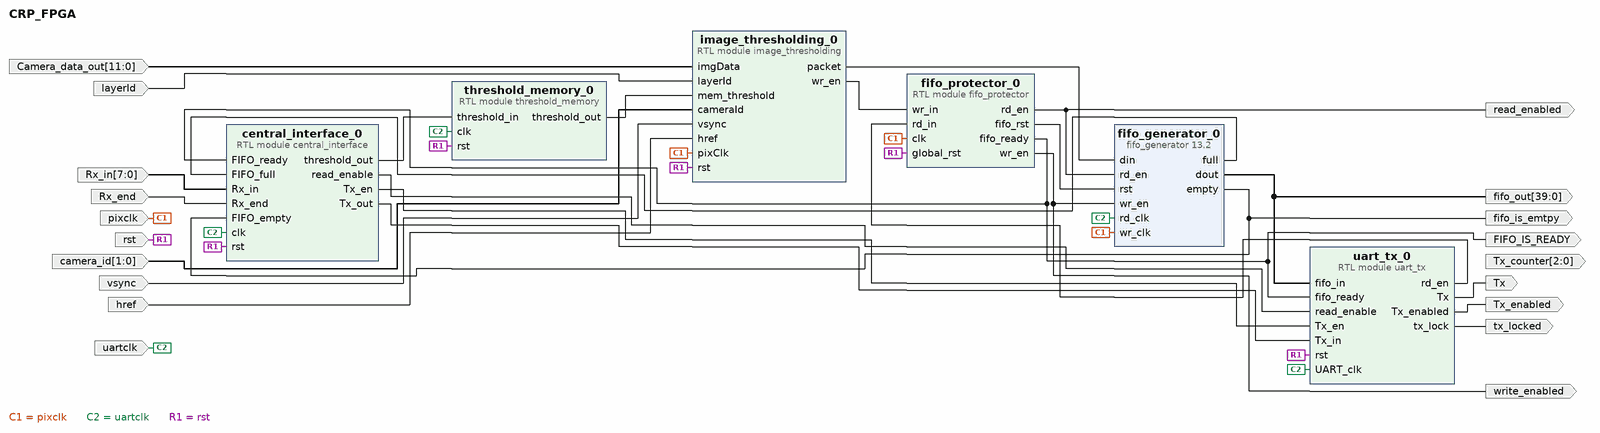
[diagram p0: block diagram of the top level]
# Vivado block design CRP_FPGA, xc7a15tcpg236-1, Vivado 2018.2
create_bd_design CRP_FPGA

create_bd_port -dir I -from 11 -to 0 Camera_data_out
create_bd_port -dir I pixclk
create_bd_port -dir I -from 7 -to 0 Rx_in
create_bd_port -dir I Rx_end
create_bd_port -dir I layerId
create_bd_port -dir I -from 1 -to 0 camera_id
create_bd_port -dir I vsync
create_bd_port -dir I href
create_bd_port -dir I rst
create_bd_port -dir I uartclk
create_bd_port -dir O -from 39 -to 0 fifo_out
create_bd_port -dir O write_enabled
create_bd_port -dir O read_enabled
create_bd_port -dir O Tx
create_bd_port -dir O Tx_enabled
create_bd_port -dir O -from 2 -to 0 Tx_counter
create_bd_port -dir O tx_locked
create_bd_port -dir O FIFO_IS_READY
create_bd_port -dir O -type data fifo_is_emtpy

create_bd_cell -type module -reference central_interface central_interface_0
create_bd_cell -type ip -vlnv xilinx.com:ip:fifo_generator:13.2 fifo_generator_0
set_property -dict [list \
  CONFIG.Fifo_Implementation Independent_Clocks_Builtin_FIFO \
  CONFIG.Input_Data_Width 40 \
] [get_bd_cells fifo_generator_0]
create_bd_cell -type module -reference fifo_protector fifo_protector_0
create_bd_cell -type module -reference threshold_memory threshold_memory_0
create_bd_cell -type module -reference image_thresholding image_thresholding_0
create_bd_cell -type module -reference uart_tx uart_tx_0

# ---- connections ----

connect_bd_net [get_bd_pins fifo_protector_0/fifo_rst] [get_bd_pins fifo_generator_0/rst]
connect_bd_net [get_bd_pins threshold_memory_0/threshold_out] [get_bd_pins image_thresholding_0/mem_threshold]
connect_bd_net -net Camera_data_in_1 [get_bd_ports Camera_data_out] [get_bd_pins image_thresholding_0/imgData]
connect_bd_net [get_bd_ports pixclk] \
  [get_bd_pins fifo_protector_0/clk] [get_bd_pins fifo_generator_0/wr_clk] [get_bd_pins image_thresholding_0/pixClk]
connect_bd_net [get_bd_ports layerId] [get_bd_pins image_thresholding_0/layerId]
connect_bd_net [get_bd_ports camera_id] [get_bd_pins image_thresholding_0/cameraId]
connect_bd_net [get_bd_ports vsync] [get_bd_pins image_thresholding_0/vsync]
connect_bd_net [get_bd_ports href] [get_bd_pins image_thresholding_0/href]
connect_bd_net [get_bd_ports uartclk] \
  [get_bd_pins threshold_memory_0/clk] [get_bd_pins fifo_generator_0/rd_clk] [get_bd_pins central_interface_0/clk] \
  [get_bd_pins uart_tx_0/UART_clk]
connect_bd_net [get_bd_pins central_interface_0/threshold_out] [get_bd_pins threshold_memory_0/threshold_in]
connect_bd_net [get_bd_pins image_thresholding_0/wr_en] [get_bd_pins fifo_protector_0/wr_in]
connect_bd_net [get_bd_pins fifo_protector_0/wr_en] [get_bd_pins fifo_generator_0/wr_en] [get_bd_ports write_enabled]
connect_bd_net [get_bd_pins fifo_protector_0/rd_en] [get_bd_pins fifo_generator_0/rd_en] [get_bd_ports read_enabled]
connect_bd_net [get_bd_pins uart_tx_0/rd_en] [get_bd_pins fifo_protector_0/rd_in]
connect_bd_net [get_bd_pins central_interface_0/read_enable] [get_bd_pins uart_tx_0/read_enable]
connect_bd_net [get_bd_ports Rx_in] [get_bd_pins central_interface_0/Rx_in]
connect_bd_net [get_bd_ports Rx_end] [get_bd_pins central_interface_0/Rx_end]
connect_bd_net [get_bd_pins fifo_protector_0/fifo_ready] \
  [get_bd_pins central_interface_0/FIFO_ready] [get_bd_ports FIFO_IS_READY] [get_bd_pins uart_tx_0/fifo_ready]
connect_bd_net [get_bd_pins fifo_generator_0/full] [get_bd_pins central_interface_0/FIFO_full]
connect_bd_net [get_bd_pins fifo_generator_0/empty] [get_bd_pins central_interface_0/FIFO_empty] [get_bd_ports fifo_is_emtpy]
connect_bd_net [get_bd_pins fifo_generator_0/dout] [get_bd_ports fifo_out] [get_bd_pins uart_tx_0/fifo_in]
connect_bd_net [get_bd_pins central_interface_0/Tx_en] [get_bd_pins uart_tx_0/Tx_en]
connect_bd_net [get_bd_pins image_thresholding_0/packet] [get_bd_pins fifo_generator_0/din]
connect_bd_net [get_bd_pins uart_tx_0/Tx] [get_bd_ports Tx]
connect_bd_net [get_bd_pins uart_tx_0/Tx_enabled] [get_bd_ports Tx_enabled]
# net uart_tx_0_data_line has one end: Tx_counter
connect_bd_net [get_bd_pins uart_tx_0/tx_lock] [get_bd_ports tx_locked]
connect_bd_net [get_bd_pins central_interface_0/Tx_out] [get_bd_pins uart_tx_0/Tx_in]
connect_bd_net [get_bd_ports rst] \
  [get_bd_pins image_thresholding_0/rst] [get_bd_pins central_interface_0/rst] [get_bd_pins fifo_protector_0/global_rst] \
  [get_bd_pins threshold_memory_0/rst] [get_bd_pins uart_tx_0/rst]

validate_bd_design
save_bd_design
